# EAGLE design PCB-BI8-2x5C3 (EAGLE 7.5.0)

## Sheet 1 of 2
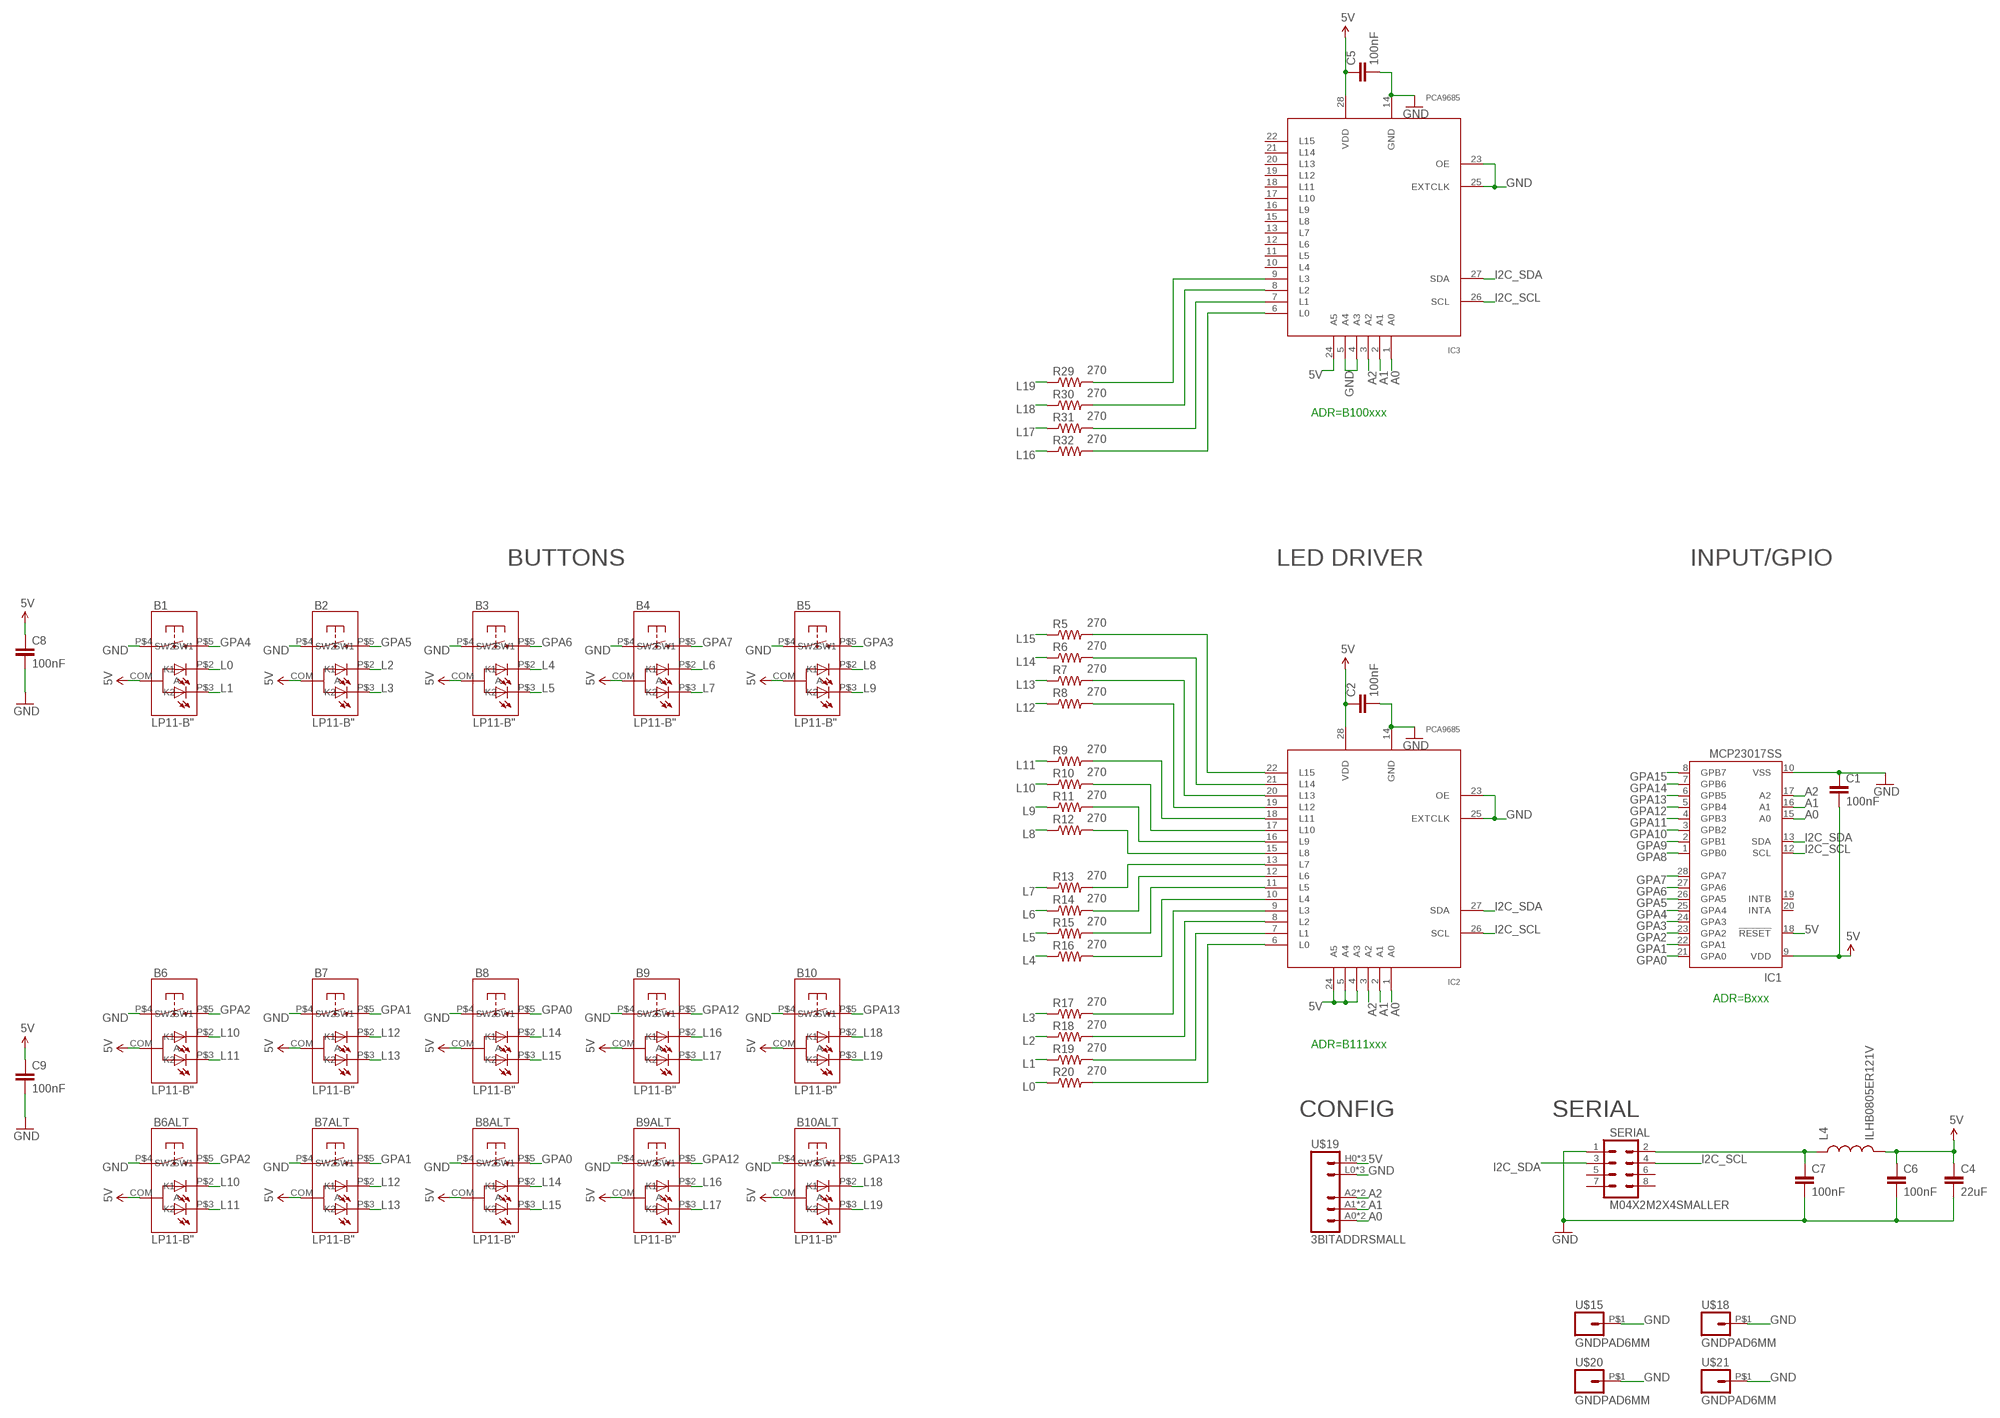
[diagram p0: schematic, sheet 1]

### Parts
B1  LP11-B"  [LP11]
B2  LP11-B"  [LP11]
B3  LP11-B"  [LP11]
B4  LP11-B"  [LP11]
B5  LP11-B"  [LP11]
B6  LP11-B"  [LP11]
B6ALT  LP11-B"  [LP11]
B7  LP11-B"  [LP11]
B7ALT  LP11-B"  [LP11]
B8  LP11-B"  [LP11]
B8ALT  LP11-B"  [LP11]
B9  LP11-B"  [LP11]
B9ALT  LP11-B"  [LP11]
B10  LP11-B"  [LP11]
B10ALT  LP11-B"  [LP11]
C1  100nF  CAP0603-CAP  [0603-CAP]
C2  100nF  CAP0603-CAP  [0603-CAP]
C4  22uF  CAP0805  [0805]
C5  100nF  CAP0603-CAP  [0603-CAP]
C6  100nF  CAP0603-CAP  [0603-CAP]
C7  100nF  CAP0603-CAP  [0603-CAP]
C8  100nF  CAP0603-CAP  [0603-CAP]
C9  100nF  CAP0603-CAP  [0603-CAP]
IC1  MCP23017SS  [SSOP28]
IC2  PCA9685  [TSSOP28]
IC3  PCA9685  [TSSOP28]
L4  ILHB0805ER121V  INDUCTOR0805  [0805]
R5  270  RESISTOR0603-RES  [0603-RES]
R6  270  RESISTOR0603-RES  [0603-RES]
R7  270  RESISTOR0603-RES  [0603-RES]
R8  270  RESISTOR0603-RES  [0603-RES]
R9  270  RESISTOR0603-RES  [0603-RES]
R10  270  RESISTOR0603-RES  [0603-RES]
R11  270  RESISTOR0603-RES  [0603-RES]
R12  270  RESISTOR0603-RES  [0603-RES]
R13  270  RESISTOR0603-RES  [0603-RES]
R14  270  RESISTOR0603-RES  [0603-RES]
R15  270  RESISTOR0603-RES  [0603-RES]
R16  270  RESISTOR0603-RES  [0603-RES]
R17  270  RESISTOR0603-RES  [0603-RES]
R18  270  RESISTOR0603-RES  [0603-RES]
R19  270  RESISTOR0603-RES  [0603-RES]
R20  270  RESISTOR0603-RES  [0603-RES]
R29  270  RESISTOR0603-RES  [0603-RES]
R30  270  RESISTOR0603-RES  [0603-RES]
R31  270  RESISTOR0603-RES  [0603-RES]
R32  270  RESISTOR0603-RES  [0603-RES]
SERIAL  M04X2M2X4SMALLER  [M2X4SMALLER]
U$15  GNDPAD6MM  [3.2MMPAD6MM]
U$18  GNDPAD6MM  [3.2MMPAD6MM]
U$19  3BITADDRSMALL  [3BITADDR_SMALL]
U$20  GNDPAD6MM  [3.2MMPAD6MM]
U$21  GNDPAD6MM  [3.2MMPAD6MM]

### Nets
5V [Power]: B1.COM(A) B2.COM(A) B3.COM(A) B4.COM(A) B5.COM(A) B6.COM(A) B6ALT.COM(A) B7.COM(A) B7ALT.COM(A) B8.COM(A) B8ALT.COM(A) B9.COM(A) B9ALT.COM(A) B10.COM(A) B10ALT.COM(A) C1.2 C2.1 C4.1 C5.1 C6.1 C8.1 C9.1 IC1.9(VDD) IC1.18(!RESET) IC2.4(A3) IC2.5(A4) IC2.24(A5) IC2.28(VDD) IC3.24(A5) IC3.28(VDD) L4.2 U$19.H0(VCC) U$19.H1(VCC) U$19.H2(VCC)
A0: IC1.15(A0) IC2.1(A0) IC3.1(A0) U$19.A0 U$19.AS0(A0)
A1: IC1.16(A1) IC2.2(A1) IC3.2(A1) U$19.A1 U$19.AS1(A1)
A2: IC1.17(A2) IC2.3(A2) IC3.3(A2) U$19.A2 U$19.AS2(A2)
GND [Power]: B1.P$4(SW1) B2.P$4(SW1) B3.P$4(SW1) B4.P$4(SW1) B5.P$4(SW1) B6.P$4(SW1) B6ALT.P$4(SW1) B7.P$4(SW1) B7ALT.P$4(SW1) B8.P$4(SW1) B8ALT.P$4(SW1) B9.P$4(SW1) B9ALT.P$4(SW1) B10.P$4(SW1) B10ALT.P$4(SW1) C1.1 C2.2 C4.2 C5.2 C6.2 C7.2 C8.2 C9.2 IC1.10(VSS) IC2.14(GND) IC2.23(OE) IC2.25(EXTCLK) IC3.4(A3) IC3.5(A4) IC3.14(GND) IC3.23(OE) IC3.25(EXTCLK) SERIAL.1 U$15.P$1 U$18.P$1 U$19.L0(GND) U$19.L1(GND) U$19.L2(GND) U$20.P$1 U$21.P$1
GPA0: B8.P$5(SW2) B8ALT.P$5(SW2) IC1.21(GPA0)
GPA1: B7.P$5(SW2) B7ALT.P$5(SW2) IC1.22(GPA1)
GPA2: B6.P$5(SW2) B6ALT.P$5(SW2) IC1.23(GPA2)
GPA3: B5.P$5(SW2) IC1.24(GPA3)
GPA4: B1.P$5(SW2) IC1.25(GPA4)
GPA5: B2.P$5(SW2) IC1.26(GPA5)
GPA6: B3.P$5(SW2) IC1.27(GPA6)
GPA7: B4.P$5(SW2) IC1.28(GPA7)
GPA8: IC1.1(GPB0)
GPA9: IC1.2(GPB1)
GPA10: IC1.3(GPB2)
GPA11: IC1.4(GPB3)
GPA12: B9.P$5(SW2) B9ALT.P$5(SW2) IC1.5(GPB4)
GPA13: B10.P$5(SW2) B10ALT.P$5(SW2) IC1.6(GPB5)
GPA14: IC1.7(GPB6)
GPA15: IC1.8(GPB7)
I2C_SCL: IC1.12(SCL) IC2.26(SCL) IC3.26(SCL) SERIAL.4
I2C_SDA: IC1.13(SDA) IC2.27(SDA) IC3.27(SDA) SERIAL.3
L0: B1.P$2(K1) R20.1
L1: B1.P$3(K2) R19.1
L2: B2.P$2(K1) R18.1
L3: B2.P$3(K2) R17.1
L4: B3.P$2(K1) R16.1
L5: B3.P$3(K2) R15.1
L6: B4.P$2(K1) R14.1
L7: B4.P$3(K2) R13.1
L8: B5.P$2(K1) R12.1
L9: B5.P$3(K2) R11.1
L10: B6.P$2(K1) B6ALT.P$2(K1) R10.1
L11: B6.P$3(K2) B6ALT.P$3(K2) R9.1
L12: B7.P$2(K1) B7ALT.P$2(K1) R8.1
L13: B7.P$3(K2) B7ALT.P$3(K2) R7.1
L14: B8.P$2(K1) B8ALT.P$2(K1) R6.1
L15: B8.P$3(K2) B8ALT.P$3(K2) R5.1
L16: B9.P$2(K1) B9ALT.P$2(K1) R32.1
L17: B9.P$3(K2) B9ALT.P$3(K2) R31.1
L18: B10.P$2(K1) B10ALT.P$2(K1) R30.1
L19: B10.P$3(K2) B10ALT.P$3(K2) R29.1
N$1 [Power]: C7.1 L4.1 SERIAL.2
N$4: IC2.13(L7) R13.2
N$5: IC2.12(L6) R14.2
N$7: IC2.11(L5) R15.2
N$8: IC3.9(L3) R29.2
N$9: IC2.10(L4) R16.2
N$10: IC2.9(L3) R17.2
N$11: IC2.8(L2) R18.2
N$12: IC2.7(L1) R19.2
N$13: IC3.8(L2) R30.2
N$14: IC3.7(L1) R31.2
N$15: IC3.6(L0) R32.2
N$19: IC2.6(L0) R20.2
N$20: IC2.15(L8) R12.2
N$21: IC2.16(L9) R11.2
N$22: IC2.17(L10) R10.2
N$23: IC2.18(L11) R9.2
N$24: IC2.19(L12) R8.2
N$25: IC2.20(L13) R7.2
N$26: IC2.21(L14) R6.2
N$27: IC2.22(L15) R5.2
Unconnected: IC1.19(INTB) IC1.20(INTA) IC3.10(L4) IC3.11(L5) IC3.12(L6) IC3.13(L7) IC3.15(L8) IC3.16(L9) IC3.17(L10) IC3.18(L11) IC3.19(L12) IC3.20(L13) IC3.21(L14) IC3.22(L15) SERIAL.5 SERIAL.6 SERIAL.7 SERIAL.8

### Notes on the sheet
- ADR=B100xxx
- BUTTONS | LED DRIVER | INPUT/GPIO
- ADR=Bxxx
- ADR=B111xxx
- CONFIG | SERIAL

## Sheet 2 of 2

## Library data of the parts
B1-B6 B6ALT B7 B7ALT B8 B8ALT B9 B9ALT B10 B10ALT = SKAARHOJ:LP11-B
C1 C2 C4-C9 = SparkFun:CAP: Capacitor Standard 0603 ceramic capacitor, and 0.1" leaded capacitor.
IC1 = microchip:MCP23017: http://ww1.microchip.com/downloads/en/DeviceDoc/21952a.pdf Source: http://ww1.microchip.com/downloads/en/DeviceDoc/21952a.pdf; MF: MICROCHIP; MPN: MCP23017-E/SS; OC_FARNELL: 1467674; OC_NEWARK: 31K2960
IC2 IC3 = wsmith:PCA9685
L4 = SparkFun:INDUCTOR: Inductors Basic Inductor/Choke - 0603 and 1206. Footprints are not proven and vary greatly between part numbers.
R5-R20 R29-R32 = SparkFun:RESISTOR: Resistor Basic schematic elements and footprints for 0603, 1206, and PTH resistors.
SERIAL = SKAARHOJ:M04X2
U$15 U$18 U$20 U$21 = SKAARHOJ:GNDPAD
U$19 = SKAARHOJ:3BITADDR

## Net classes
0 default: width 0.203 mm, drill 0.406 mm, clearance 0.203 mm
1 Power: width 0.406 mm, drill 0.61 mm, clearance 0.203 mm

## Board
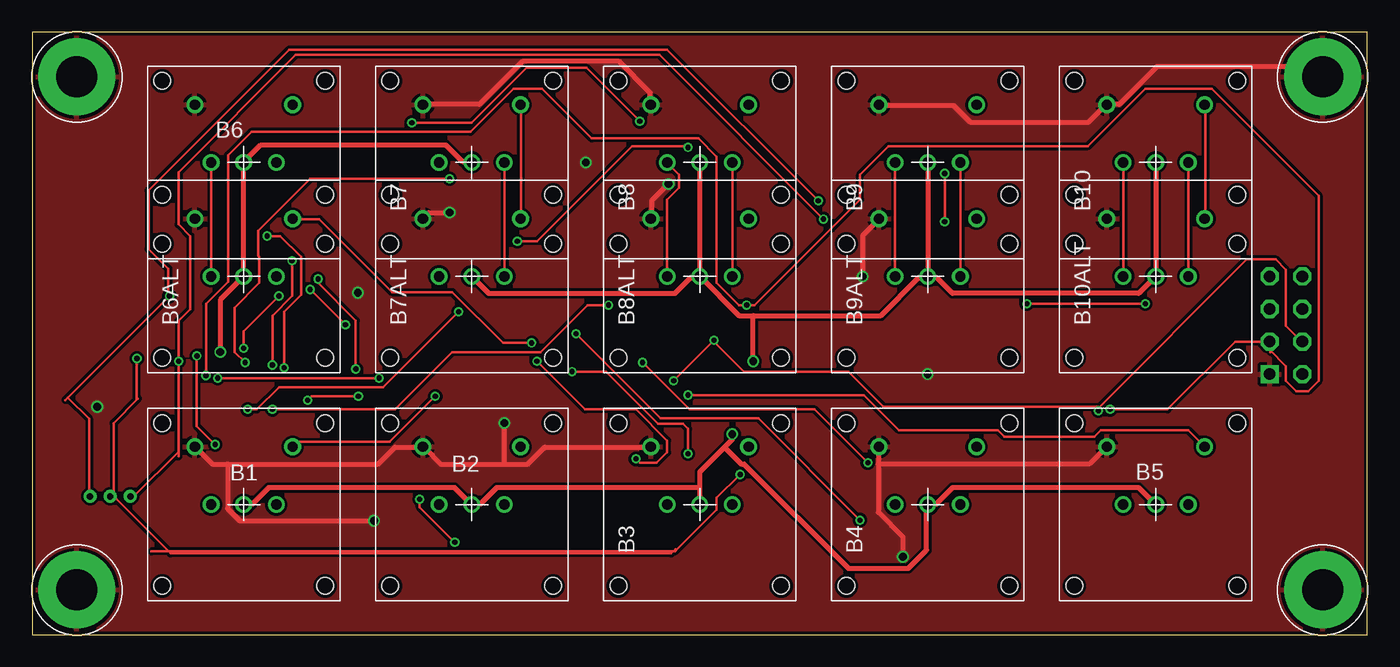
[diagram p1: board, top side]
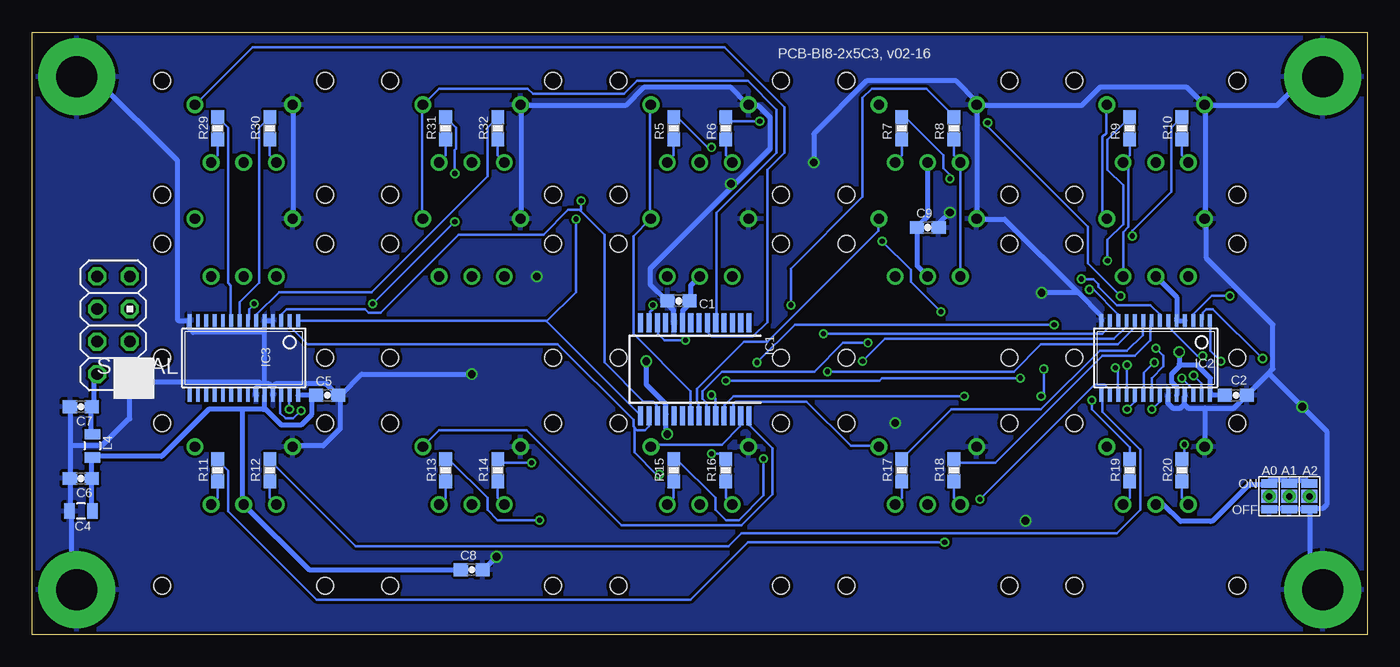
[diagram p2: board, bottom side, seen from below]

Size 104.14 x 46.99 mm. Coordinates in mm from the lower left corner, seen from the top.
Outline: 0,0 104.14,0 104.14,46.99 0,46.99 0,0
Copper layers (1*16): Top 0.035mm / dielectric 1.5mm / Bottom 0.035mm
Design rules "Fusion_eagle_rule_v1.1": minimum track width 6mil, minimum drill 12mil, track to track 6mil, track to pad 6mil, pad to pad 6mil, via to via 6mil, smd to smd 0mil, copper to edge 10mil, drill to drill 10mil, minimum pad ring 10mil, minimum via ring 6mil, stop-mask expansion 2mil, vias tented up to drill 100mil, thermal gap 10mil

### Footprints (pad centres in the part's own frame; a part is rotated, then mirrored left to right if it is on the bottom)
LP11 = drill 0.8: COM 0,0; P$2 0,2.54; P$3 0,-2.54; P$4 4.5,3.81; P$5 4.5,-3.81 | hole 1.3: -6.35,6.35; 6.35,6.35; 6.35,-6.35; -6.35,-6.35
0603-CAP = smd 1.1 x 1: 1 -0.85,0; 2 0.85,0
0805 = smd 0.8 x 1.2: 1 -0.9,0; 2 0.9,0
SSOP28 = smd 0.4 x 1.5: 1 -4.225,-3.625; 2 -3.575,-3.625; 3 -2.925,-3.625; 4 -2.275,-3.625; 5 -1.625,-3.625; 6 -0.975,-3.625; 7 -0.325,-3.625; 8 0.325,-3.625; 9 0.975,-3.625; 10 1.625,-3.625; 11 2.275,-3.625; 12 2.925,-3.625; 13 3.575,-3.625; 14 4.225,-3.625; 15 4.225,3.625; 16 3.575,3.625; 17 2.925,3.625; 18 2.275,3.625; 19 1.625,3.625; 20 0.975,3.625; 21 0.325,3.625; 22 -0.325,3.625; 23 -0.975,3.625; 24 -1.625,3.625; 25 -2.275,3.625; 26 -2.925,3.625; 27 -3.575,3.625; 28 -4.225,3.625
TSSOP28 = smd 0.305 x 0.991: 1 -4.225,-2.918; 2 -3.575,-2.918; 3 -2.925,-2.918; 4 -2.275,-2.918; 5 -1.625,-2.918; 6 -0.975,-2.918; 7 -0.325,-2.918; 8 0.325,-2.918; 9 0.975,-2.918; 10 1.625,-2.918; 11 2.275,-2.918; 12 2.925,-2.918; 13 3.575,-2.918; 14 4.225,-2.918; 15 4.225,2.918; 16 3.575,2.918; 17 2.925,2.918; 18 2.275,2.918; 19 1.625,2.918; 20 0.975,2.918; 21 0.325,2.918; 22 -0.325,2.918; 23 -0.975,2.918; 24 -1.625,2.918; 25 -2.275,2.918; 26 -2.925,2.918; 27 -3.575,2.918; 28 -4.225,2.918
0603-RES = smd 1.1 x 1: 1 -0.85,0; 2 0.85,0
M2X4SMALLER = drill 0.9 square: 1 -1.27,3.81 | drill 0.9 octagon: 2 1.27,3.81; 3 -1.27,1.27; 4 1.27,1.27; 5 -1.27,-1.27; 6 1.27,-1.27; 7 -1.27,-3.81; 8 1.27,-3.81
3.2MMPAD6MM = drill 3.2 pad 6: P$1 0,0
3BITADDR_SMALL = drill 0.5: A0 -1.565,0; A1 0,0; A2 1.565,0 | smd 1.27 x 1: AS0 -1.565,0; AS1 0,0; AS2 1.565,0 | smd 1.27 x 0.635: H0 -1.565,1; H1 0,1; H2 1.565,1; L0 -1.565,-1; L1 0,-1; L2 1.565,-1

### Placement (x,y rotation side)
B1  16.51,10.16 90 top
B2  34.29,10.16 90 top
B3  52.07,10.16 90 top
B4  69.85,10.16 90 top
B5  87.63,10.16 90 top
B6  16.51,36.83 90 top
B6ALT  16.51,27.94 90 top
B7  34.29,36.83 90 top
B7ALT  34.29,27.94 90 top
B8  52.07,36.83 90 top
B8ALT  52.07,27.94 90 top
B9  69.85,36.83 90 top
B9ALT  69.85,27.94 90 top
B10  87.63,36.83 90 top
B10ALT  87.63,27.94 90 top
C1  53.72,26.04 0 bottom
C2  10.26,18.67 0 bottom
C4  100.33,9.65 180 bottom
C5  81.13,18.67 0 bottom
C6  100.33,12.19 180 bottom
C7  100.33,17.78 180 bottom
C8  69.85,5.08 0 bottom
C9  34.29,31.75 0 bottom
IC1  52.45,20.7 180 bottom
IC2  16.51,21.59 180 bottom
IC3  87.63,21.59 180 bottom
L4  99.44,14.73 270 bottom
R5  54.1,39.5 90 bottom
R6  50.04,39.5 90 bottom
R7  36.32,39.5 90 bottom
R8  32.26,39.5 90 bottom
R9  18.54,39.5 90 bottom
R10  14.48,39.5 90 bottom
R11  89.66,12.83 90 bottom
R12  85.6,12.83 90 bottom
R13  71.88,12.83 90 bottom
R14  67.82,12.83 90 bottom
R15  54.1,12.83 90 bottom
R16  50.04,12.83 90 bottom
R17  36.32,12.83 90 bottom
R18  32.26,12.83 90 bottom
R19  18.54,12.83 90 bottom
R20  14.48,12.83 90 bottom
R29  89.66,39.5 90 bottom
R30  85.6,39.5 90 bottom
R31  71.88,39.5 90 bottom
R32  67.82,39.5 90 bottom
SERIAL  97.79,24.13 180 bottom
U$15  3.5,3.5 0 top
U$18  100.64,3.5 0 top
U$19  6.1,10.79 0 bottom
U$20  3.5,43.49 0 top
U$21  100.64,43.49 0 top

### Tracks (layer width: path | path; a pad name or v marks a point on that pad's centre or on a via)
5V  (via drill 0.61)
  Top 0.406: B9.COM B9ALT.COM | B10.COM B10ALT.COM 86.31,26.62 71.78,26.62 70.56,27.84 69.95,27.84 B9ALT.COM | B8ALT.COM B8.COM | v14.68,22.05 14.68,26.11 B6ALT.COM B6.COM 16.61,36.98 17.83,38.2 32.26,38.2 33.58,36.88 34.29,36.88 B7.COM | B7ALT.COM 35.61,26.62 50.14,26.62 51.36,27.84 51.97,27.84 B8ALT.COM | 56.24,24.89 55.12,24.89 B8ALT.COM | 56.24,24.89 66.19,24.89 69.14,27.84 69.75,27.84 B9ALT.COM | B5.COM 86.31,11.48 71.78,11.48 70.46,10.16 B4.COM 69.75,10.06 69.75,6.6 68.33,5.18 63.65,5.18 55.52,13.31 55.32,13.31 54,14.63 | v54.61,15.65 54.61,15.24 54,14.63 | 54,14.63 52.07,12.7 52.07,11.48 | B3.COM 52.07,11.48 | 52.07,11.48 36.22,11.48 34.9,10.16 B2.COM 32.97,11.48 18.44,11.48 17.12,10.16 B1.COM | v56.24,21.34 56.24,24.89
  Bottom 0.406: IC1.9 53.39,24.38 53.39,25.3 52.88,25.81 52.88,26.01 C1.2 52.78,26.21 52.78,27.23 B8ALT.COM | B7ALT.COM 35.1,28.75 35.1,31.7 C9.1 35,31.9 34.29,32.61 B7.COM | C2.1 11.12,18.69 12.24,18.69 IC2.28 12.24,18.9 12.24,20.02 13.26,21.03 14.58,21.03 | 14.58,21.03 15.29,20.32 15.29,19.71 14.88,19.3 14.88,18.69 IC2.24 | IC2.4 14.28,24.49 14.88,24.49 IC2.5 14.88,24.69 14.88,26.31 B6ALT.COM | v14.68,22.05 14.68,21.13 14.58,21.03 | C4.1 99.52,9.65 99.52,12.09 C6.1 99.52,12.19 99.52,13.82 L4.2 99.31,13.92 94.03,13.92 90.37,17.58 87.73,17.58 | IC3.28 83.36,18.69 82.04,18.69 C5.1 82.35,18.59 82.35,17.17 83.16,16.36 84.68,16.36 86,17.68 | 86,17.68 86,18.59 IC3.24 | 87.73,17.58 86.11,17.58 86,17.68 | C8.1 82.55,5.08 B5.COM 87.73,10.26 87.73,17.58 | B1.COM 15.9,10.16 14.58,8.84 12.24,8.84 12.06,8.89 9.21,11.75 7.94,11.75 U$19.H0 7.62,12.06 6.35,12.06 U$19.H1 6.03,12.06 4.76,12.06 U$19.H2 | v54.61,15.65 54.71,15.75 54.71,17.07 IC1.18 54.71,17.27 54.71,17.98 56.24,19.51 v56.24,21.34
A0  (via drill 0.41)
  Top 0.203: 11.43,13.92 11.43,14.29 | 11.43,14.29 v11.43,21.34 11.43,24.49 12.34,25.4 12.34,31.09 11.43,32 11.43,36.07 20.57,45.21 48.92,45.21 v61.72,32.41 | 11.43,14.29 7.94,10.79 U$19.AS0
  Bottom 0.203: v11.43,21.34 12.24,22.15 12.24,24.49 IC2.1 | 64.01,24.43 56.74,17.17 IC1.15 | 64.01,24.43 64.06,24.49 83.36,24.49 IC3.1 | v61.72,32.41 61.72,26.72 64.01,24.43 | 7.94,10.79 U$19.AS0
A1  (via drill 0.41)
  Top 0.203: 8.18,18.39 8.18,18.41 | 8.18,18.41 v8.18,21.54 | 9.3,6.5 50.14,6.5 50.23,6.6 | 50.23,6.6 53.39,9.75 53.39,10.67 v55.22,12.5 | 6.35,10.79 6.35,16.51 8.26,18.41 8.18,18.41 | 6.35,10.79 10.79,6.35 49.85,6.35 50.16,6.67 50.23,6.6 | 6.35,10.79 U$19.AS1
  Bottom 0.203: v8.18,21.54 12.04,25.4 12.55,25.4 12.85,25.09 12.85,24.59 IC2.2 | 57.1,16.1 56.95,15.95 56.34,15.95 56.03,16.26 56.03,17.07 IC1.16 | 57.1,16.1 57.25,16.26 57.25,16.76 63.14,22.66 82.65,22.66 83.97,23.98 83.97,24.49 IC3.2 | v55.22,12.5 55.42,12.5 57.15,14.22 57.15,16.05 57.1,16.1 | 6.35,10.79 U$19.AS1
A2  (via drill 0.41)
  Top 0.203: 2.59,18.29 2.79,18.48 | 2.79,18.48 v10.72,26.42 10.62,26.42 10.62,28.55 9.09,30.07 9.09,34.65 20.07,45.62 49.53,45.62 v61.32,33.83 | 2.79,18.48 4.45,16.83 4.45,10.79 U$19.AS2
  Bottom 0.203: v10.72,26.42 12.14,26.42 13.56,24.99 13.56,24.59 IC2.3 | 61.37,33.07 59.49,31.19 59.49,21.23 56.44,18.19 55.73,18.19 55.42,17.88 55.42,17.17 IC1.17 | 61.37,33.07 61.42,33.12 62.33,33.12 64.26,31.19 70.87,31.19 76.96,25.09 77.88,25.09 78.18,25.4 84.28,25.4 84.68,24.99 84.68,24.59 IC3.3 | v61.32,33.83 61.32,33.12 61.37,33.07 | 4.76,10.79 U$19.AS2
GND  (via drill 0.6, 0.61)
  Top 0.406: v32.56,32.92 30.94,32.92 30.53,32.51 B7ALT.P$4 | 4.83,3.56 U$15.P$1 | 15.24,13.31 14.07,13.31 12.75,14.63 B1.P$4 | 15.24,13.31 26.98,13.31 28.3,14.63 30.43,14.63 B2.P$4 30.63,14.53 31.85,13.31 36.83,13.31 | 36.83,13.31 38.66,13.31 39.98,14.63 48.21,14.63 B3.P$4 | v67.92,6.1 67.92,7.62 65.99,9.55 65.99,13.31 | 65.99,13.31 65.99,14.63 B4.P$4 | 65.99,13.31 82.45,13.31 83.77,14.63 B5.P$4 | v49.63,35.15 48.31,33.83 48.31,32.51 B8ALT.P$4 | U$21.P$1 99.31,43.59 98.6,44.3 87.73,44.3 84.78,41.35 83.87,41.35 B10.P$4 83.67,41.25 82.35,39.93 73.2,39.93 71.88,41.25 66.09,41.25 B9.P$4 | B7.P$4 30.53,41.35 34.9,41.35 38.25,44.7 45.77,44.7 48.21,42.27 48.21,41.35 B8.P$4 | v26.67,8.89 16.19,8.89 15.24,9.84 15.24,13.31 | 15.24,13.34 15.24,13.31 | 36.83,13.31 v36.83,16.51 | v64.77,27.94 64.77,31.11 66.04,32.38 B9ALT.P$4
  Bottom 0.406: 22.55,26.66 28.3,32.41 30.43,32.41 B7ALT.P$4 30.43,32.61 30.43,41.25 B7.P$4 | 22.55,26.66 20.78,24.89 20.78,24.59 IC2.14 | v32.56,32.92 33.38,32.11 33.38,31.8 C9.2 | B6.P$4 12.65,41.25 12.65,32.51 B6ALT.P$4 12.55,32.31 12.55,29.36 7.37,24.18 7.37,20.73 7.7,20.4 | B6.P$4 12.45,41.25 7.06,41.25 4.83,43.48 U$20.P$1 | B7.P$4 30.23,41.25 22.3,41.25 20.88,42.67 14.07,42.67 12.85,41.45 B6.P$4 | 14.28,17.98 14.28,18.59 IC2.25 | 14.28,17.98 14.58,17.68 15.19,17.68 15.6,18.09 15.6,18.59 IC2.23 | 12.65,17.68 13.97,17.68 14.28,17.98 | 12.65,17.68 10.41,17.68 9.5,18.59 C2.2 9.3,18.8 7.7,20.4 | 12.65,17.68 12.65,14.73 B1.P$4 | 101.14,14.73 101.14,12.29 C6.2 101.14,12.19 101.14,9.65 C4.2 101.04,9.55 101.04,5.18 99.42,3.56 U$18.P$1 | 101.14,14.73 101.14,17.78 C7.2 | v67.92,6.1 68.94,5.08 C8.2 | IC3.4 85.39,24.49 86,24.49 IC3.5 86,24.28 86,23.57 | 85.39,19.3 85.39,18.69 IC3.25 | 85.39,19.3 85.7,19.61 86,19.61 | 86.31,19.61 86,19.61 | 86.31,19.61 86.72,19.2 86.72,18.69 IC3.23 | 85.39,19.3 85.09,19.61 81.23,19.61 80.31,18.69 C5.2 | 86,19.61 86,23.57 | B5.P$4 83.77,14.73 81.43,14.73 80.11,16.05 80.11,18.59 C5.2 | 86,23.57 91.59,23.57 91.9,23.88 91.9,24.28 IC3.14 91.9,24.49 92.71,24.49 92.81,24.59 92.81,36.98 99.31,43.48 U$21.P$1 | 101.14,14.73 98.7,14.73 96.67,16.76 96.52,16.83 96.52,19.68 | B9ALT.P$4 65.99,32.51 65.99,41.25 B9.P$4 65.79,41.25 57.86,41.25 56.44,42.67 49.63,42.67 48.41,41.45 B8.P$4 48.21,41.25 47.5,41.25 46.58,40.34 46.58,37.9 49.43,35.05 | IC1.10 54.1,24.38 54.1,25.3 54.51,25.7 54.51,26.01 C1.1 54.71,26.11 55.93,27.33 55.93,28.55 49.43,35.05 | v49.63,35.15 49.53,35.15 49.43,35.05
  Bottom 0.406: B10ALT.P$4 83.77,32.51 83.77,41.25 B10.P$4 | U$19.L2 4.76,9.84 6.03,9.84 U$19.L1 6.35,9.84 7.62,9.84 U$19.L0 | U$15.P$1 4.45,4.45 4.45,9.53 U$19.L2 | 7.7,20.4 v5.08,17.78 3.17,15.88 3.17,10.16 3.49,9.84 4.45,9.84 U$19.L2 | v25.4,26.67 22.54,26.67 22.55,26.66 | v43.18,36.83 43.18,39.05 39.05,43.18 32.07,43.18 30.48,41.59 B7.P$4 | v69.85,20.32 78.42,20.32 80.01,18.73 C5.2 | 96.52,19.68 86.36,19.68 86.31,19.61 | 96.52,19.68 SERIAL.1
  pour Top: 0,0 104.14,0 104.14,46.99 0,46.99
  pour Bottom: 0,0 104.14,0 104.14,46.99 0,46.99
GPA0
  Bottom 0.203: IC1.21 52.78,17.17 52.78,19 57.25,23.47 57.25,31.09 55.93,32.41 B8ALT.P$5 55.93,32.51 55.93,41.25 B8.P$5
GPA1
  Top 0.203: B7.P$5 38.15,41.25 38.15,32.51 B7ALT.P$5
  Bottom 0.203: IC1.22 52.17,17.17 52.17,18.09 52.27,18.19 52.27,19.2 48.62,22.86 46.79,22.86 38.15,31.5 38.15,32.41 B7ALT.P$5
GPA2  (via drill 0.41)
  Top 0.203: v38.96,22.76 36.73,22.76 32.77,26.72 28.09,26.72 22.4,32.41 20.37,32.41 B6ALT.P$5
  Bottom 0.203: v38.96,22.76 40.89,22.76 43.13,20.52 50.34,20.52 51.87,19 51.87,18.39 51.56,18.09 51.56,17.17 IC1.23 | B6.P$5 20.37,41.25 20.37,39.12 20.68,38.81 20.68,32.82 20.37,32.51 B6ALT.P$5
GPA3  (via drill 0.41)
  Top 0.203: v51.16,18.69 64.87,18.69 67.61,15.95 75.34,15.95 75.84,15.44 82.86,15.44 83.36,15.95 90.17,15.95 91.39,14.73 B5.P$5
  Bottom 0.203: v51.16,18.69 50.85,18.39 50.85,17.17 IC1.24
GPA4  (via drill 0.41)
  Top 0.203: v31.45,18.59 27.89,15.04 20.68,15.04 20.37,14.73 B1.P$5
  Bottom 0.203: v31.45,18.59 49.43,18.59 50.14,17.88 50.14,17.17 IC1.25
GPA5
  Bottom 0.203: IC1.26 49.43,17.17 49.43,17.98 49.23,18.19 43.74,18.19 40.28,14.73 38.15,14.73 B2.P$5
GPA6
  Bottom 0.203: IC1.27 48.92,17.07 48.92,16.26 50.34,14.83 55.73,14.83 55.83,14.73 B3.P$5
GPA7
  Bottom 0.203: IC1.28 48.21,17.07 48.21,16.36 46.38,14.53 46.38,10.97 48.82,8.53 58.17,8.53 65.58,15.95 72.39,15.95 73.61,14.73 B4.P$5
GPA12
  Bottom 0.203: IC1.5 50.75,24.38 50.75,32.92 46.08,37.59 46.08,40.95 48.31,43.18 56.95,43.18 57.96,42.16 65.08,42.16 65.48,42.57 72.39,42.57 73.61,41.35 B9.P$5 73.71,41.25 73.71,32.51 B9ALT.P$5
GPA13
  Top 0.203: B10ALT.P$5 91.49,32.51 91.49,41.25 B10.P$5
  Bottom 0.203: IC1.6 51.46,24.28 51.46,23.57 51.16,23.27 47.9,23.27 46.79,24.38 46.79,36.27 45.47,37.59 45.47,41.15 50.14,45.82 86.92,45.82 91.39,41.35 B10.P$5
I2C_SCL  (via drill 0.41)
  Top 0.203: SERIAL.4 99.01,22.86 97.79,24.08 97.79,28.45 96.98,29.26 94.74,29.26 83.16,17.68 v83.16,17.48 83.16,17.78 66.4,17.78 63.65,20.52 55.52,20.52 53.19,22.86 v53.19,22.96 v50.04,19.81 | v27.08,20.02 v14.48,20.02
  Bottom 0.203: v83.16,17.48 83.77,16.87 84.38,16.87 84.78,17.27 84.78,18.59 IC3.26 | v14.48,20.02 13.66,19.2 13.66,18.69 IC2.26 | v27.08,20.02 37.85,20.02 38.05,19.81 v50.04,19.81 | v53.19,22.96 54.81,22.96 55.32,23.47 55.32,24.28 IC1.12
I2C_SDA  (via drill 0.41)
  Top 0.203: v84.07,17.58 88.54,17.58 93.83,22.86 SERIAL.3 | v13.56,20.22 13.56,25.81 15.29,27.53 15.29,37.39 17.12,39.22 34.19,39.22 37.54,42.57 39.78,42.57 43.64,38.71 51.97,38.71 53.39,37.29 53.39,27.43 55.12,25.7 v55.73,25.7 56.34,25.7 64.57,33.93 64.57,35.87 66.8,38.1 82.35,38.1 86.82,42.57 92,42.57 100.33,34.24 100.33,19.81 99.52,19 98.6,19 97.79,19.81 97.79,20.95 96.52,22.23 SERIAL.3 | 96.57,22.05 96.57,22.86 SERIAL.3
  Bottom 0.203: v84.07,17.58 84.07,18.59 IC3.27 | v13.56,20.22 12.95,19.61 12.95,18.69 IC2.27 | v55.73,25.7 55.73,25.4 55.93,25.2 55.93,24.38 IC1.13
L0
  Bottom 0.203: R20.1 14.48,10.67 B1.P$2
L1
  Bottom 0.203: R19.1 18.54,10.67 B1.P$3
L2
  Bottom 0.203: R18.1 32.26,10.67 B2.P$2
L3
  Bottom 0.203: R17.1 36.32,10.67 B2.P$3
L4
  Bottom 0.203: R16.1 50.04,10.67 B3.P$2
L5
  Bottom 0.203: R15.1 54.1,10.67 B3.P$3
L6
  Bottom 0.203: R14.1 67.82,10.67 B4.P$2
L7
  Bottom 0.203: R13.1 71.88,10.67 B4.P$3
L8
  Bottom 0.203: R12.1 85.6,10.67 B5.P$2
L9
  Bottom 0.203: R11.1 89.66,10.67 B5.P$3
L10
  Top 0.203: B6.P$2 B6ALT.P$2
  Bottom 0.203: R10.1 14.48,37.39 13.97,36.88 B6.P$2
L11
  Bottom 0.203: R9.1 18.54,37.39 19.05,36.88 B6.P$3 19.05,36.78 18.64,36.37 18.64,31.8 19.05,31.39 B6ALT.P$3
L12
  Bottom 0.203: R8.1 32.26,37.39 31.75,36.88 B7.P$2 B7ALT.P$2
L13
  Top 0.203: B7.P$3 B7ALT.P$3
  Bottom 0.203: R7.1 36.32,37.39 36.83,36.88 B7.P$3
L14
  Top 0.203: B8ALT.P$2 49.53,33.93 50.44,34.85 50.44,35.87 49.53,36.78 B8.P$2
  Bottom 0.203: R6.1 50.04,37.39 49.53,36.88 B8.P$2
L15
  Top 0.203: B8.P$3 B8ALT.P$3
  Bottom 0.203: R5.1 54.1,37.39 54.61,36.88 B8.P$3
L16
  Top 0.203: B9.P$2 B9ALT.P$2
  Bottom 0.203: R32.1 67.82,37.39 67.31,36.88 B9.P$2
L17
  Top 0.203: B9.P$3 B9ALT.P$3
  Bottom 0.203: R31.1 71.88,37.39 72.39,36.88 B9.P$3
L18
  Top 0.203: B10.P$2 B10ALT.P$2
  Bottom 0.203: R30.1 85.6,37.39 85.09,36.88 B10.P$2
L19
  Top 0.203: B10.P$3 B10ALT.P$3
  Bottom 0.203: R29.1 89.66,37.39 90.17,36.88 B10.P$3
N$1
  Bottom 0.406: L4.1 99.52,15.65 99.52,17.78 C7.1 99.31,17.88 99.31,20.12 99.11,20.32 SERIAL.2
N$4  (via drill 0.41)
  Top 0.203: v42.42,23.47 49.02,16.87 56.64,16.87 v64.57,8.94
  Bottom 0.203: v42.42,23.47 20.68,23.47 20.17,23.98 20.17,24.49 IC2.13 | v64.57,8.94 67.82,8.94 68.63,9.75 68.63,10.67 71.58,13.61 71.88,13.61 R13.2
N$5  (via drill 0.41)
  Top 0.203: v24.43,24.18 v21.69,26.92 | v47.6,21.23 51.26,17.58 61.01,17.58 v65.18,13.41
  Bottom 0.203: v21.69,26.92 21.39,26.92 19.46,24.99 19.46,24.59 IC2.12 | v24.43,24.18 44.65,24.18 v47.6,21.23 | v65.18,13.41 67.61,13.41 67.82,13.61 R14.2
N$7  (via drill 0.41)
  Top 0.203: v39.37,21.34 43.13,17.58 47.09,17.58 49.53,15.14 49.53,14.22 48.72,13.41 47.4,13.41 v47.09,13.72
  Bottom 0.203: v39.37,21.34 37.64,23.06 19.76,23.06 18.85,23.98 18.85,24.49 IC2.11 | v47.09,13.72 47.09,10.87 49.02,8.94 50.04,8.94 50.85,9.75 50.85,10.67 53.8,13.61 54.1,13.61 R15.2
N$8
  Bottom 0.203: IC3.9 88.65,24.59 88.65,27.23 88.85,27.43 88.85,39.52 89.66,40.34 R29.2
N$9  (via drill 0.41)
  Top 0.203: v42.11,20.52 44.76,20.52 48.82,16.46 50.75,16.46 51.16,16.05 v51.16,14.12
  Bottom 0.203: v42.11,20.52 27.58,20.52 25.45,22.66 19.46,22.66 18.14,23.98 18.14,24.49 IC2.10 | v51.16,14.12 50.44,14.12 50.04,13.72 R16.2
N$10
  Bottom 0.203: IC2.9 17.53,24.49 17.53,23.37 18.75,22.15 20.88,22.15 25.45,17.58 32.46,17.58 36.32,13.72 R17.2
N$11
  Bottom 0.203: IC2.8 16.92,24.49 16.92,22.96 18.14,21.74 20.68,21.74 29.01,13.41 32.05,13.41 32.26,13.61 R18.2
N$12  (via drill 0.41)
  Top 0.203: v22.3,27.74 22.3,27.43 25.25,24.49 v25.25,20.73 | v25.45,18.59 21.79,18.59 v21.49,18.29
  Bottom 0.203: v22.3,27.74 21.39,27.74 20.98,27.33 20.98,27.13 19.56,25.7 16.92,25.7 16.2,24.99 16.2,24.59 IC2.7 | v25.25,20.73 25.25,18.8 v25.45,18.59 | v21.49,18.29 21.49,17.58 18.54,14.63 R19.2
N$13
  Bottom 0.203: IC3.8 87.94,24.59 87.94,25.91 86.41,27.43 86.41,39.52 85.6,40.34 R30.2
N$14  (via drill 0.41)
  Top 0.203: v77.57,25.81 v86.82,25.81 | v71.17,35.97 v71.17,32.21
  Bottom 0.203: v86.82,25.81 87.22,25.4 87.22,24.59 IC3.7 | v71.17,32.21 v77.57,25.81 | v71.17,35.97 71.17,37.8 71.07,37.9 71.07,39.52 71.88,40.34 R31.2
N$15
  Bottom 0.203: IC3.6 86.61,24.59 86.61,24.99 84.89,26.72 77.67,26.72 68.63,35.76 68.63,39.52 67.82,40.34 R32.2
N$19  (via drill 0.41)
  Top 0.203: v12.85,21.74 12.85,16.26 v14.28,14.83
  Bottom 0.203: v12.85,21.74 13.26,21.74 15.49,23.98 15.49,24.49 IC2.6 | v14.28,14.83 14.28,13.92 14.48,13.72 R20.2
N$20
  Bottom 0.203: IC2.15 20.68,18.59 20.68,17.37 17.73,14.43 17.73,9.75 19.56,7.92 48.82,7.92 49.84,6.91 78.89,6.91 85.6,13.61 R12.2
N$21  (via drill 0.41)
  Top 0.203: v30.23,10.57 30.23,9.96 v32.97,7.21
  Bottom 0.203: v30.23,10.57 21.29,19.51 20.47,19.51 20.17,19.2 20.17,18.69 IC2.16 | v32.97,7.21 48.31,7.21 52.78,2.74 81.94,2.74 88.85,9.65 88.85,12.8 89.66,13.61 R11.2
N$22  (via drill 0.41)
  Top 0.203: v19.66,20.83 19.66,25.2 20.98,26.52 20.98,29.46 19.36,31.09 v18.34,31.09
  Bottom 0.203: v19.66,20.83 19.46,20.62 19.46,18.69 IC2.17 | v18.34,31.09 18.34,31.5 15.29,34.54 15.29,39.52 14.48,40.34 R10.2
N$23  (via drill 0.41)
  Top 0.203: v18.75,21.03 18.75,24.89 20.27,26.42 v20.27,29.16
  Bottom 0.203: v18.75,21.03 18.75,18.69 IC2.18 | v20.27,29.16 20.27,30.79 19.05,32 19.05,35.05 20.27,36.27 20.27,38.61 18.54,40.34 R9.2
N$24  (via drill 0.41)
  Top 0.203: v18.75,17.58 28.3,17.58 32.77,22.05 39.67,22.05 43.33,25.7 v44.96,25.7
  Bottom 0.203: v18.75,17.58 18.14,18.19 18.14,18.59 IC2.19 | v44.96,25.7 44.96,28.55 39.37,34.14 39.37,41.86 38.66,42.57 34.39,42.57 32.26,40.44 R8.2
N$25  (via drill 0.41)
  Top 0.203: v16.61,21.23 15.8,22.05 15.8,25.5 17.73,27.43 17.73,29.46 17.63,29.57 17.63,31.5 21.69,35.56 v32.56,35.56
  Bottom 0.203: v16.61,21.23 17.42,20.42 17.42,18.69 IC2.20 | v32.56,35.56 32.56,35.87 33.07,36.37 33.07,37.39 36.02,40.34 36.32,40.34 R7.2
N$26  (via drill 0.41)
  Top 0.203: v16.51,22.35 16.51,23.67 v19.25,26.42 | v29.62,39.93 34.29,39.93 38.56,44.2 43.23,44.2 v47.4,40.03
  Bottom 0.203: v16.51,22.35 15.9,21.74 15.9,20.93 16.82,20.02 16.82,18.69 IC2.21 | v19.25,26.42 21.79,28.96 21.79,31.8 29.62,39.62 v29.62,39.93 | v47.4,40.03 49.73,40.03 50.04,40.34 R6.2
N$27  (via drill 0.41)
  Top 0.203: v16.82,17.58 17.53,17.58 19.25,19.3 27.38,19.3 v33.27,25.2 | v37.85,30.68 39.37,30.68 46.79,38.1 51.05,38.1 v51.16,38
  Bottom 0.203: v16.82,17.58 16.2,18.19 16.2,18.59 IC2.22 | v33.27,25.2 35.61,27.53 35.61,28.45 v37.85,30.68 | v51.16,38 51.46,38 53.8,40.34 54.1,40.34 R5.2

### Text on the board
_bsilk: PCB-BI8-2x5C3, v02-16